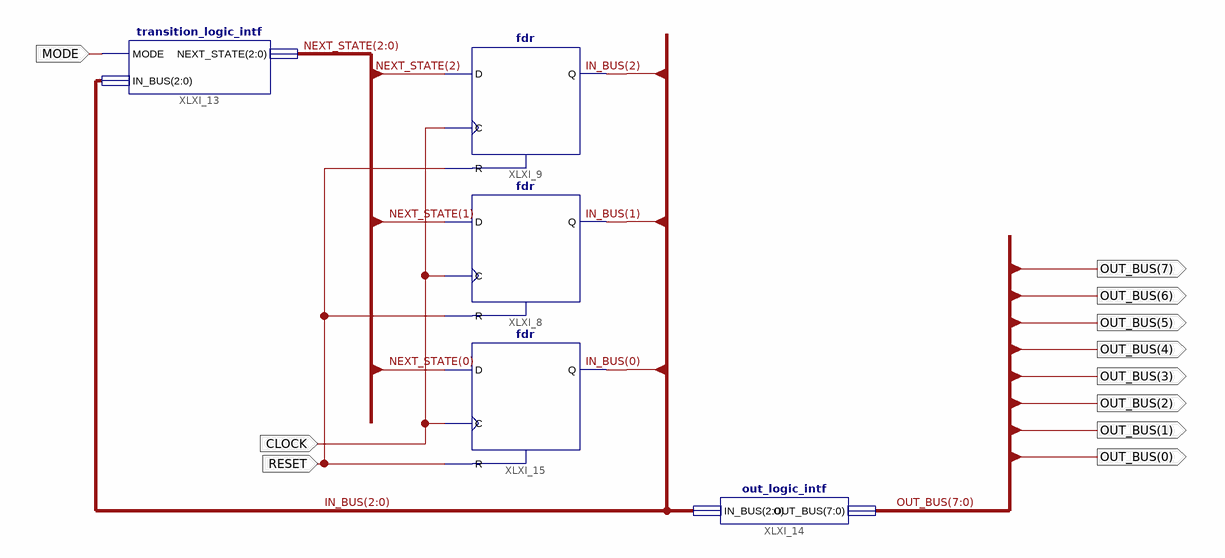
[diagram p0: schematic sheet 1]
// Xilinx ISE schematic LigthController.sch (spartan3a) as structural Verilog: 5 symbols, 11 ports
module LigthController (
  input  MODE,
  input  CLOCK,
  input  RESET,
  output [7:0] OUT_BUS
);

  wire [2:0] IN_BUS, NEXT_STATE;

  fdr XLXI_8 (.C(CLOCK), .D(NEXT_STATE[1]), .R(RESET), .Q(IN_BUS[1]));
  fdr XLXI_9 (.C(CLOCK), .D(NEXT_STATE[2]), .R(RESET), .Q(IN_BUS[2]));
  transition_logic_intf XLXI_13 (.MODE(MODE), .IN_BUS(IN_BUS), .NEXT_STATE(NEXT_STATE));
  out_logic_intf XLXI_14 (.IN_BUS(IN_BUS), .OUT_BUS(OUT_BUS));
  fdr XLXI_15 (.C(CLOCK), .D(NEXT_STATE[0]), .R(RESET), .Q(IN_BUS[0]));
endmodule
